# Altium project EECM.PrjPcb
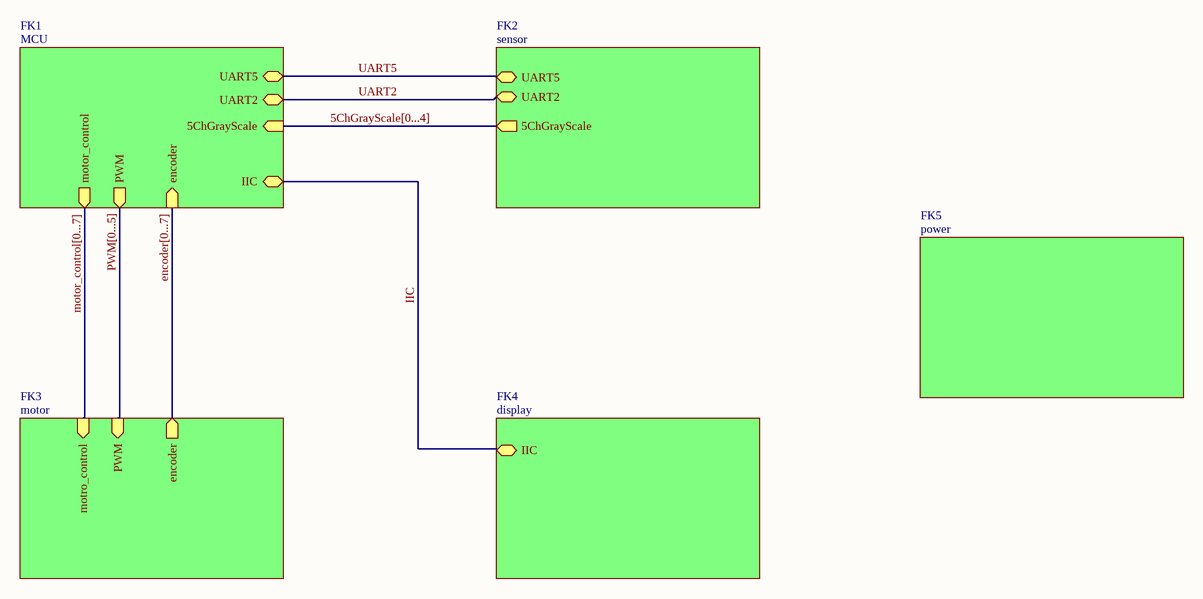
[diagram p0: parent.SchDoc]
6 sheets, 29 parts. Net scope: hierarchical (ports join the sheet entries above them; power ports are global).
Sheets:
  parent.SchDoc
    FK1 = MCU.SchDoc
    FK2 = sensor.SchDoc
    FK3 = motor.SchDoc
    FK4 = display.SchDoc
    FK5 = power.SchDoc

## Sheet parent.SchDoc
size A4; SheetNumber: 1; SheetTotal: 6

### Sub-sheets
FK1 = MCU: UART2 (bidir), UART5 (bidir), IIC (bidir), motor_control (out), PWM (out), 5ChGrayScale (in), encoder (in)
FK2 = sensor: 5ChGrayScale (out), UART2 (bidir), UART5 (bidir)
FK3 = motor: motro_control (in), PWM (in), encoder (out)
FK4 = display: IIC (bidir)
FK5 = power: no entries

### Nets
5ChGrayScale[0...4]: sheet FK1/5ChGrayScale, sheet FK2/5ChGrayScale
encoder[0...7]: sheet FK1/encoder, sheet FK3/encoder
IIC: sheet FK1/IIC, sheet FK4/IIC
motor_control[0...7]: sheet FK1/motor_control, sheet FK3/motro_control
PWM[0...5]: sheet FK1/PWM, sheet FK3/PWM
UART2: sheet FK1/UART2, sheet FK2/UART2
UART5: sheet FK1/UART5, sheet FK2/UART5

## Sheet MCU.SchDoc
size A4; SheetNumber: 2; SheetTotal: 6; SPICEModelCacheEPLXUDEV: <root> / <DocumentId>EPLXUDEV</DocumentId> / <CacheFrame Number="0"> / <Model Name="spstrelay" Kind="CKT"> / <Text>*SPST Relay Subcircuit Parameters / *PULLIN     = Pull in voltage / *DROPOFF    = Drop off voltage / *CONTACT    = Contact resistance / *RESISTANCE = Coil resistance / *INDUCTANCE = Coil Inductance / * jjt 15/6/2002: changed DPST model to SPST. / * / *Generic DPST Relay / *Connections:     NO_A1 / *                 | NO_A2 / *                 | | T1 / *                 | | | T2 / *                 | | | | / *                 | | | | / *                 | | | | / *                 | | | | / .SUBCKT SPSTRELAY 1 2 4 5 / + PARAMS: PULLIN=4 DROPOFF=0.1 CONTACT=1m RESISTANCE=500 INDUCTANCE=10m / L1 4 6 {(INDUCTANCE/2)} / L2 5 7 {(INDUCTANCE/2)} / R1 6 7 {RESISTANCE} / * / BNO1 8 0 V={PULLIN}-abs(v(6,7)) / SW1 1 2 8 0 SWNO OFF / * / .MODEL SWNO SW(VT={(PULLIN*0.98)} RON={CONTACT} ) / .ENDS SPSTRELAY</Text> / </Model> / </CacheFrame> / </root>
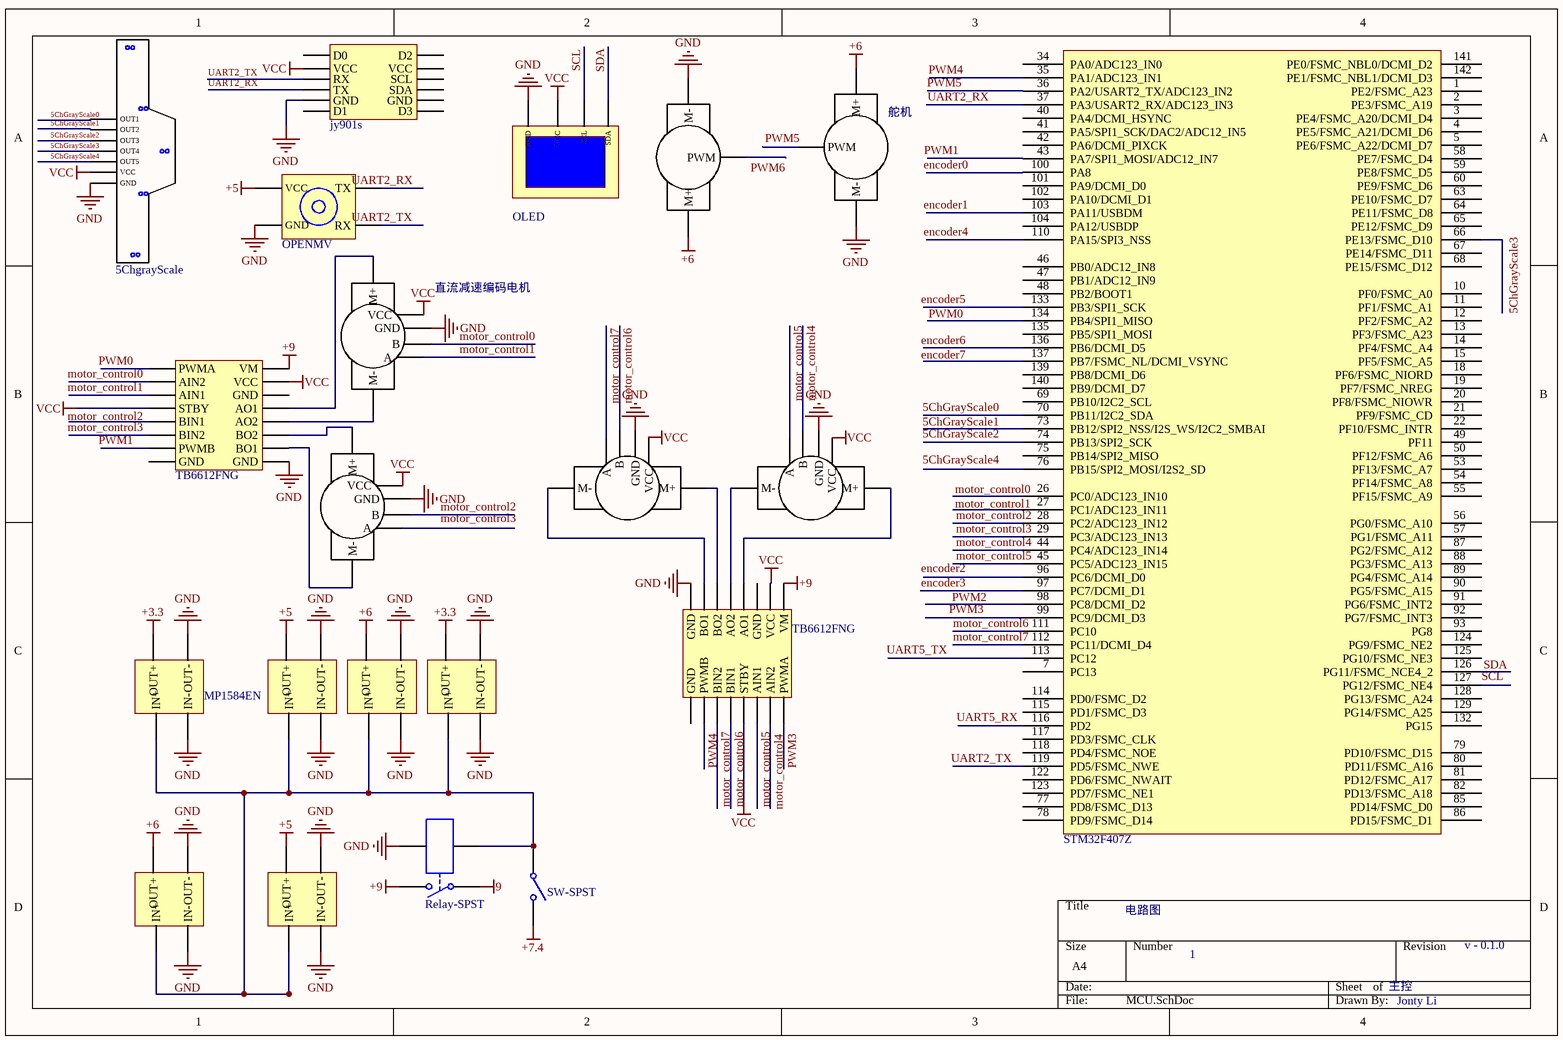
[diagram p1: MCU.SchDoc]

### Parts
(Parts that share a designator on the sheet are numbered #1, #2 ... from top to bottom, then left to right.)
*?#1  5ChgrayScale
*?#2  MP1584EN
*?#3  MP1584EN  (value not drawn)
*?#4  MP1584EN  (value not drawn)
*?#5  MP1584EN  (value not drawn)
*?#6  MP1584EN  (value not drawn)
*?#7  MP1584EN  (value not drawn)
display?  OLED
K?#1  Relay-SPST  [MODULE4]
M?#1  舵机
M?#2  舵机  (value not drawn)
M?#3  直流减速编码电机
M?#4  直流减速编码电机  (value not drawn)
M?#5  直流减速编码电机  (value not drawn)
M?#6  直流减速编码电机  (value not drawn)
S?#1  SW-SPST  [SPST-2]
U1  STM32F407Z  [TQFP144_N]  (part A of 2)
U*?#1  jy901s
U*?#2  OPENMV
U*?#3  TB6612FNG
U*?#4  TB6612FNG

### Nets
9: K?#1.1
+3.3: *?#2.2(OUT+) *?#5.2(OUT+)
+5: *?#3.2(OUT+) *?#7.2(OUT+) U*?#2.0(VCC)
+6: *?#4.2(OUT+) *?#6.2(OUT+) M?#1.0(M+) M?#2.0(M+)
+9: K?#1.2 U*?#3.15(VM) U*?#4.15(VM)
GND: *?#1.6(GND) *?#2.1(IN-) *?#2.3(OUT-) *?#3.1(IN-) *?#3.3(OUT-) *?#4.1(IN-) *?#4.3(OUT-) *?#5.1(IN-) *?#5.3(OUT-) *?#6.1(IN-) *?#6.3(OUT-) *?#7.1(IN-) *?#7.3(OUT-) display?.0(GND) K?#1.4 M?#1.1(M-) M?#2.1(M-) M?#3.4(GND) M?#4.4(GND) M?#5.4(GND) M?#6.4(GND) U*?#1.4(GND) U*?#2.1(GND) U*?#3.8(GND) U*?#4.8(GND)
VCC: *?#1.5(VCC) display?.1(VCC) M?#3.3(VCC) M?#5.3(VCC) M?#6.3(VCC) U*?#1.1(VCC) U*?#3.3(STBY) U*?#3.14(VCC) U*?#4.3(STBY) U*?#4.14(VCC)
5ChGrayScale0: *?#1.0(OUT1) U1.70(PB11/I2C2_SDA)
5ChGrayScale1: *?#1.1(OUT2)
5ChGrayScale2: *?#1.2(OUT3)
5ChGrayScale3: *?#1.3(OUT4)
5ChGrayScale4: *?#1.4(OUT5)
encoder0: U1.100(PA8)
encoder1: U1.103(PA11/USBDM)
encoder3: U1.97(PC7/DCMI_D1)
encoder4: U1.110(PA15/SPI3_NSS)
encoder5: U1.133(PB3/SPI1_SCK)
encoder6: U1.136(PB6/DCMI_D5)
motor_control0: M?#3.5(B) U*?#3.1(AIN2)
motor_control1: M?#3.6(A) U*?#3.2(AIN1)
motor_control2: M?#6.5(B) U1.28(PC2/ADC123_IN12)
motor_control3: U1.29(PC3/ADC123_IN13) U*?#3.5(BIN2)
motor_control4: M?#5.5(B) U1.44(PC4/ADC123_IN14) U*?#4.1(AIN2)
motor_control5: M?#5.6(A) U1.45(PC5/ADC123_IN15) U*?#4.2(AIN1)
motor_control6: M?#4.5(B) U1.111(PC10) U*?#4.4(BIN1)
motor_control7: M?#4.6(A) U1.112(PC11/DCMI_D4) U*?#4.5(BIN2)
PWM0: U*?#3.0(PWMA)
PWM1: U1.43(PA7/SPI1_MOSI/ADC12_IN7) U*?#3.6(PWMB)
PWM3: U*?#4.0(PWMA)
PWM4: U1.35(PA1/ADC123_IN1) U*?#4.6(PWMB)
PWM5: U1.36(PA2/USART2_TX/ADC123_IN2)
SCL: display?.2(SCL)
SDA: display?.3(SDA)
UART2_RX: U1.37(PA3/USART2_RX/ADC123_IN3) U*?#1.3(TX) U*?#2.2(TX)
UART2_TX: U1.119(PD5/FSMC_NWE) U*?#1.2(RX) U*?#2.3(RX)
UART5_RX: U1.116(PD2)
UART5_TX: U1.113(PC12)
Net*?#2_0: *?#2.0(IN+) *?#3.0(IN+) *?#4.0(IN+) *?#5.0(IN+) *?#6.0(IN+) *?#7.0(IN+) K?#1.3 S?#1.1(COMMON)
NetM?#3_1: M?#3.1(M+) U*?#3.12(AO1)
NetM?#3_2: M?#3.2(M-) U*?#3.11(AO2)
NetM?#4_1: M?#4.1(M+) U*?#4.10(BO2)
NetM?#4_2: M?#4.2(M-) U*?#4.9(BO1)
NetM?#5_1: M?#5.1(M+) U*?#4.12(AO1)
NetM?#5_2: M?#5.2(M-) U*?#4.11(AO2)
NetM?#6_1: M?#6.1(M+) U*?#3.10(BO2)
NetM?#6_2: M?#6.2(M-) U*?#3.9(BO1)

Not connected (* = marked no-connect by the designer): M?#1 2(PWM); M?#2 2(PWM); M?#4 3(VCC); M?#6 6(A); S?#1 2(NO); U1 1(PE2/FSMC_A23) 2(PE3/FSMC_A19) 3(PE4/FSMC_A20/DCMI_D4) 4(PE5/FSMC_A21/DCMI_D6) 5(PE6/FSMC_A22/DCMI_D7) 7(PC13) 10(PF0/FSMC_A0) 11(PF1/FSMC_A1) 12(PF2/FSMC_A2) 13(PF3/FSMC_A23) 14(PF4/FSMC_A4) 15(PF5/FSMC_A5) 18(PF6/FSMC_NIORD) 19(PF7/FSMC_NREG) 20(PF8/FSMC_NIOWR) 21(PF9/FSMC_CD) 22(PF10/FSMC_INTR) 26(PC0/ADC123_IN10) 27(PC1/ADC123_IN11) 34(PA0/ADC123_IN0) 40(PA4/DCMI_HSYNC) 41(PA5/SPI1_SCK/DAC2/ADC12_IN5) 42(PA6/DCMI_PIXCK) 46(PB0/ADC12_IN8) 47(PB1/ADC12_IN9) 48(PB2/BOOT1) 49(PF11) 50(PF12/FSMC_A6) 53(PF13/FSMC_A7) 54(PF14/FSMC_A8) 55(PF15/FSMC_A9) 56(PG0/FSMC_A10) 57(PG1/FSMC_A11) 58(PE7/FSMC_D4) 59(PE8/FSMC_D5) 60(PE9/FSMC_D6) 63(PE10/FSMC_D7) 64(PE11/FSMC_D8) 65(PE12/FSMC_D9) 66(PE13/FSMC_D10) 67(PE14/FSMC_D11) 68(PE15/FSMC_D12) 69(PB10/I2C2_SCL) 73(PB12/SPI2_NSS/I2S_WS/I2C2_SMBAI) 74(PB13/SPI2_SCK) 75(PB14/SPI2_MISO) 76(PB15/SPI2_MOSI/I2S2_SD) 77(PD8/FSMC_D13) 78(PD9/FSMC_D14) 79(PD10/FSMC_D15) 80(PD11/FSMC_A16) 81(PD12/FSMC_A17) 82(PD13/FSMC_A18) 85(PD14/FSMC_D0) 86(PD15/FSMC_D1) 87(PG2/FSMC_A12) 88(PG3/FSMC_A13) 89(PG4/FSMC_A14) 90(PG5/FSMC_A15) 91(PG6/FSMC_INT2) 92(PG7/FSMC_INT3) 93(PG8) 96(PC6/DCMI_D0) 98(PC8/DCMI_D2) 99(PC9/DCMI_D3) 101(PA9/DCMI_D0) 102(PA10/DCMI_D1) 104(PA12/USBDP) 114(PD0/FSMC_D2) 115(PD1/FSMC_D3) 117(PD3/FSMC_CLK) 118(PD4/FSMC_NOE) 122(PD6/FSMC_NWAIT) 123(PD7/FSMC_NE1) 124(PG9/FSMC_NE2) 125(PG10/FSMC_NE3) 126(PG11/FSMC_NCE4_2) 127(PG12/FSMC_NE4) 128(PG13/FSMC_A24) 129(PG14/FSMC_A25) 132(PG15) 134(PB4/SPI1_MISO) 135(PB5/SPI1_MOSI) 137(PB7/FSMC_NL/DCMI_VSYNC) 139(PB8/DCMI_D6) 140(PB9/DCMI_D7) 141(PE0/FSMC_NBL0/DCMI_D2) 142(PE1/FSMC_NBL1/DCMI_D3); U*?#1 0(D0) 5(D1) 6(D3) 7(GND) 8(SDA) 9(SCL) 10(VCC) 11(D2); U*?#3 4(BIN1) 7(GND) 13(GND); U*?#4 7(GND) 13(GND)

### Notes on the sheet
- 电路图
- 1
- 主控
- v - 0.1.0
- Jonty Li
- Labels drawn without touching a wire or pin: 5ChGrayScale1, 5ChGrayScale2, 5ChGrayScale3, 5ChGrayScale4, +7.4, encoder2, encoder7, motor_control0, motor_control1, motor_control2, motor_control3, PWM0, PWM2, PWM3, PWM5, PWM6, SCL, SDA, VCC

### Library data of the parts
K?#1 = Relay-SPST: Single-Pole Single-Throw Relay; Published: 24-Mar-1999; LatestRevisionDate: 17-Jul-2002; LatestRevisionNote: Re-released for DXP Platform.; PackageReference: MODULE4; Publisher: Altium Limited
M?#1 M?#2 = servo
M?#3-M?#6 = motor
S?#1 = SW-SPST: Single-Pole, Single-Throw Switch; Published: 24-Mar-1999; LatestRevisionDate: 17-Jul-2002; LatestRevisionNote: Re-released for DXP Platform.; PackageReference: SPST-2; Publisher: Altium Limited; PackageDescription: Switch; 2 Leads
U1 = STM32F407Z: STM32单片机144引脚

## Sheet sensor.SchDoc
size A4; SheetNumber: 3; SheetTotal: 6

## Sheet motor.SchDoc
size A4; SheetNumber: 5; SheetTotal: 6

## Sheet display.SchDoc
size A4; SheetNumber: 6; SheetTotal: 6

## Sheet power.SchDoc
size A4; SheetNumber: 4; SheetTotal: 6; SPICEModelCacheBNSZVLDZ: <root> / <DocumentId>BNSZVLDZ</DocumentId> / <CacheFrame Number="0"> / <Model Name="spstrelay" Kind="CKT"> / <Text>*SPST Relay Subcircuit Parameters / *PULLIN     = Pull in voltage / *DROPOFF    = Drop off voltage / *CONTACT    = Contact resistance / *RESISTANCE = Coil resistance / *INDUCTANCE = Coil Inductance / * jjt 15/6/2002: changed DPST model to SPST. / * / *Generic DPST Relay / *Connections:     NO_A1 / *                 | NO_A2 / *                 | | T1 / *                 | | | T2 / *                 | | | | / *                 | | | | / *                 | | | | / *                 | | | | / .SUBCKT SPSTRELAY 1 2 4 5 / + PARAMS: PULLIN=4 DROPOFF=0.1 CONTACT=1m RESISTANCE=500 INDUCTANCE=10m / L1 4 6 {(INDUCTANCE/2)} / L2 5 7 {(INDUCTANCE/2)} / R1 6 7 {RESISTANCE} / * / BNO1 8 0 V={PULLIN}-abs(v(6,7)) / SW1 1 2 8 0 SWNO OFF / * / .MODEL SWNO SW(VT={(PULLIN*0.98)} RON={CONTACT} ) / .ENDS SPSTRELAY</Text> / </Model> / </CacheFrame> / </root>
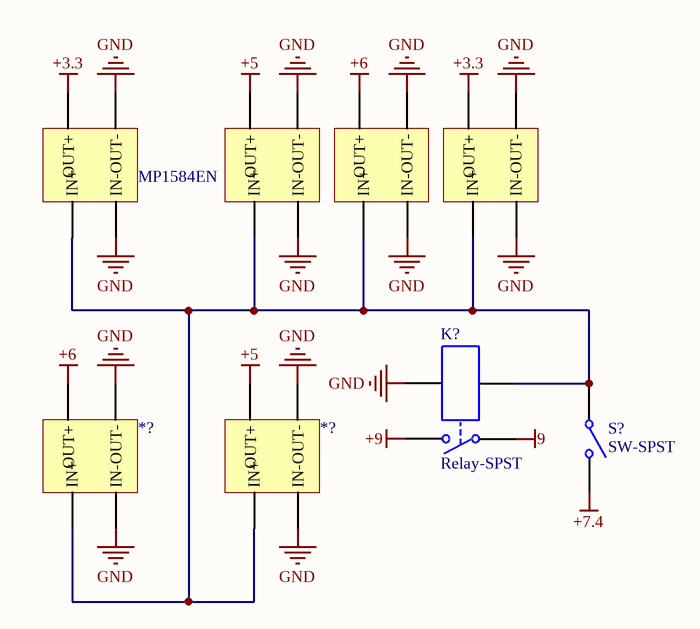
[diagram p2: power.SchDoc]

### Parts
(Parts that share a designator on the sheet are numbered #1, #2 ... from top to bottom, then left to right.)
*?#8  MP1584EN
*?#9  MP1584EN  (value not drawn)
*?#10  MP1584EN  (value not drawn)
*?#11  MP1584EN  (value not drawn)
*?#12  MP1584EN  (value not drawn)
*?#13  MP1584EN  (value not drawn)
K?#2  Relay-SPST  [MODULE4]
S?#2  SW-SPST  [SPST-2]

### Nets
9: K?#2.1
+3.3: *?#8.2(OUT+) *?#11.2(OUT+)
+5: *?#9.2(OUT+) *?#13.2(OUT+)
+6: *?#10.2(OUT+) *?#12.2(OUT+)
+9: K?#2.2
GND: *?#8.1(IN-) *?#8.3(OUT-) *?#9.1(IN-) *?#9.3(OUT-) *?#10.1(IN-) *?#10.3(OUT-) *?#11.1(IN-) *?#11.3(OUT-) *?#12.1(IN-) *?#12.3(OUT-) *?#13.1(IN-) *?#13.3(OUT-) K?#2.4
Net*?#8_0: *?#8.0(IN+) *?#9.0(IN+) *?#10.0(IN+) *?#11.0(IN+) *?#12.0(IN+) *?#13.0(IN+) K?#2.3 S?#2.1(COMMON)

Not connected (* = marked no-connect by the designer): S?#2 2(NO)

### Notes on the sheet
- Labels drawn without touching a wire or pin: +7.4

### Library data of the parts
K?#2 = Relay-SPST: Single-Pole Single-Throw Relay; Published: 24-Mar-1999; LatestRevisionDate: 17-Jul-2002; LatestRevisionNote: Re-released for DXP Platform.; PackageReference: MODULE4; Publisher: Altium Limited
S?#2 = SW-SPST: Single-Pole, Single-Throw Switch; Published: 24-Mar-1999; LatestRevisionDate: 17-Jul-2002; LatestRevisionNote: Re-released for DXP Platform.; PackageReference: SPST-2; Publisher: Altium Limited; PackageDescription: Switch; 2 Leads

## Nets that join several sheets
9: MCU (K?#1.1), power (K?#2.1)
+3.3: MCU (*?#2.2 *?#5.2), power (*?#8.2 *?#11.2)
+5: MCU (*?#3.2 *?#7.2 U*?#2.0), power (*?#9.2 *?#13.2)
+6: MCU (*?#4.2 *?#6.2 M?#1.0 M?#2.0), power (*?#10.2 *?#12.2)
+9: MCU (K?#1.2 U*?#3.15 U*?#4.15), power (K?#2.2)
GND: MCU (25 pins), power (13 pins)